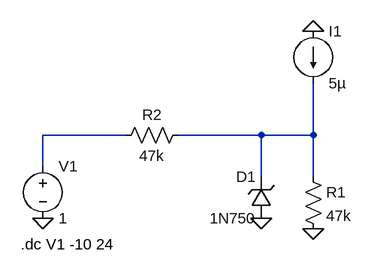
[diagram p0: schematic RegulatorEnPin.asc]
RegulatorEnPin.asc, the LTspice schematic file:
Version 4
SHEET 1 880 680
WIRE -96 80 -224 80
WIRE 112 80 -16 80
WIRE 192 80 192 0
WIRE 192 80 112 80
WIRE -224 128 -224 80
WIRE 112 144 112 80
WIRE 192 144 192 80
FLAG 112 208 0
FLAG 192 224 0
FLAG 192 -80 0
FLAG -224 208 0
SYMBOL res 176 128 R0
SYMATTR InstName R1
SYMATTR Value 47k
SYMBOL res 0 64 R90
WINDOW 0 0 56 VBottom 2
WINDOW 3 32 56 VTop 2
SYMATTR InstName R2
SYMATTR Value 47k
SYMBOL zener 128 208 R180
WINDOW 0 24 64 Left 2
WINDOW 3 24 0 Left 2
SYMATTR InstName D1
SYMATTR Value 1N750
SYMATTR Description Diode
SYMATTR Type diode
SYMBOL current 192 -80 R0
WINDOW 123 0 0 Left 0
WINDOW 39 0 0 Left 0
SYMATTR InstName I1
SYMATTR Value 5µ
SYMBOL voltage -224 112 R0
WINDOW 123 0 0 Left 0
WINDOW 39 0 0 Left 0
SYMATTR InstName V1
SYMATTR Value 1
TEXT -258 248 Left 2 !.dc V1 -10 24

The netlist it stands for:
* RegulatorEnPin.asc
R1 N002 0 47k
R2 N002 N001 47k
D1 0 N002 1N750
I1 0 N002 5µ
V1 N001 0 1
.model D D
.lib standard.dio
.dc V1 -10 24
.backanno
.end